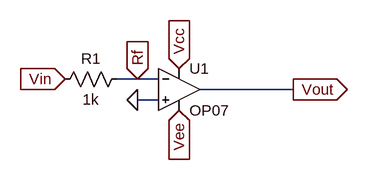
[diagram p0: schematic VGA.asc]
VGA.asc, the LTspice schematic file:
Version 4
SHEET 1 880 680
WIRE 96 160 64 160
WIRE 128 160 96 160
WIRE 336 176 192 176
WIRE 128 192 96 192
FLAG 96 192 0
FLAG 160 144 Vcc
IOPIN 160 144 In
FLAG 160 208 Vee
IOPIN 160 208 In
FLAG -16 160 Vin
IOPIN -16 160 In
FLAG 336 176 Vout
IOPIN 336 176 Out
FLAG 96 160 Rf
IOPIN 96 160 In
SYMBOL OpAmps\\OP07 160 112 R0
SYMATTR InstName U1
SYMBOL res 80 144 R90
WINDOW 0 0 56 VBottom 2
WINDOW 3 32 56 VTop 2
SYMATTR InstName R1
SYMATTR Value 1k

The netlist it stands for:
* VGA.asc
XU1 0 Rf Vcc Vee Vout LT1001  ; OP07, pins In+ In- V+ V- OUT
R1 Rf Vin 1k
.lib LTC.lib
.backanno
.end